# Altium project MCP33151 Eval Board.PrjPcb (part 2 of 3)

## Sheet Digital IO Protection.SchDoc: Digital IO Protection
size B; DrawnBy: Jasper Yun; SheetNumber: 6; SheetTotal: 11; Competition: SAC 2021; Subteam: Avionics; University: McGill University; Location: Montreal, Quebec; Project: Avionics Project Name; MRT: McGill Rocket Team
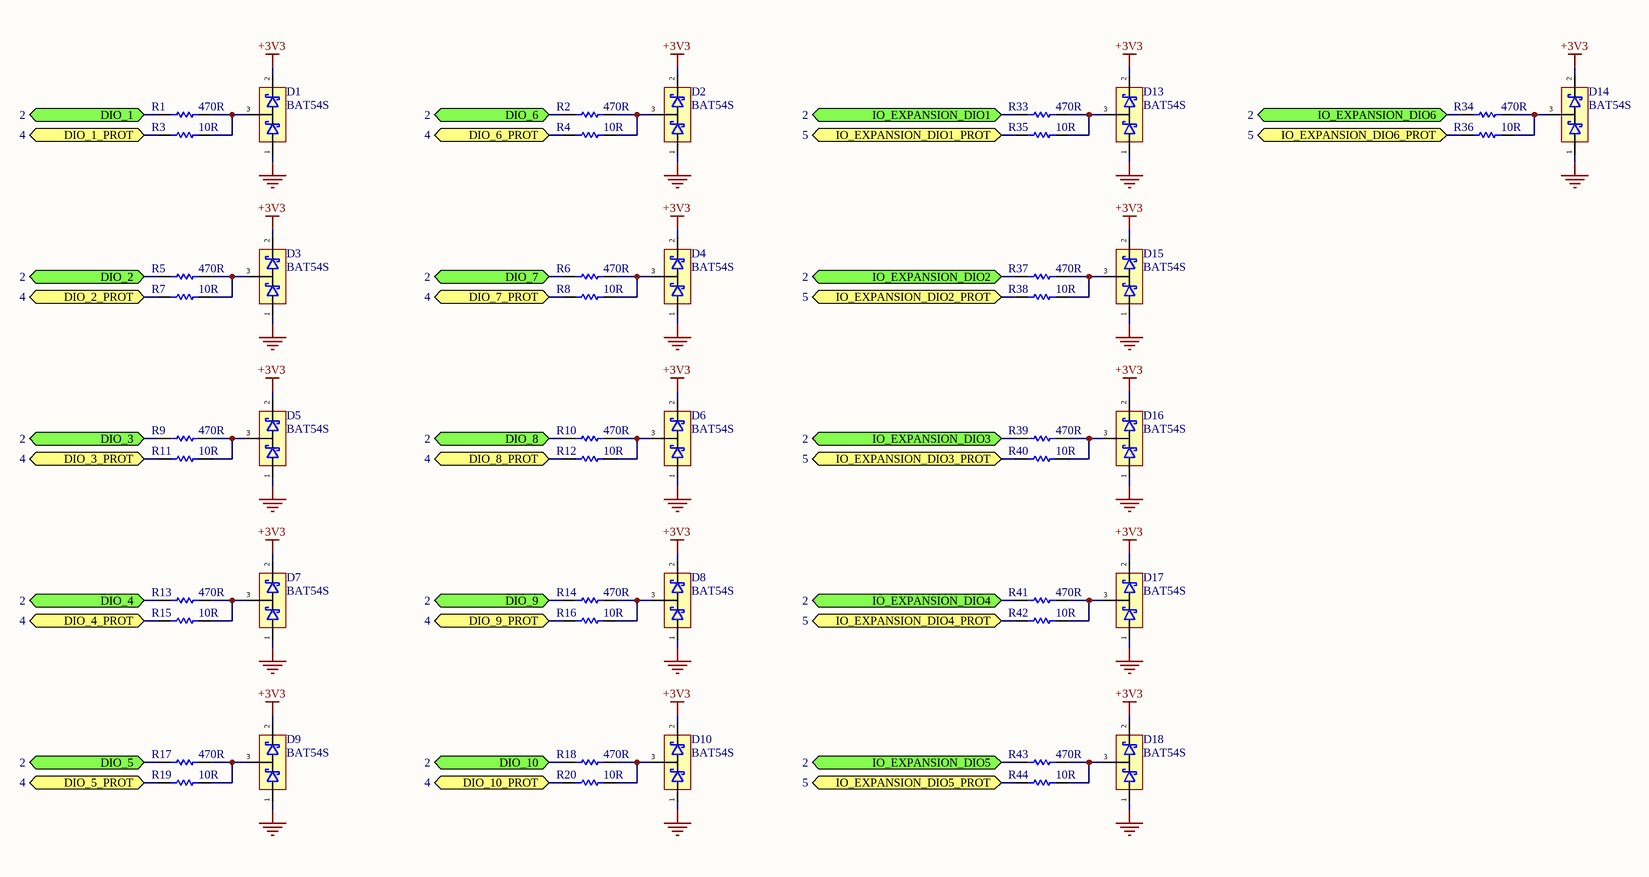
[diagram p5: Digital IO Protection.SchDoc]

### Parts
D1  BAT54S  [SOT23-3]
D2  BAT54S  [SOT23-3]
D3  BAT54S  [SOT23-3]
D4  BAT54S  [SOT23-3]
D5  BAT54S  [SOT23-3]
D6  BAT54S  [SOT23-3]
D7  BAT54S  [SOT23-3]
D8  BAT54S  [SOT23-3]
D9  BAT54S  [SOT23-3]
D10  BAT54S  [SOT23-3]
D13  BAT54S  [SOT23-3]
D14  BAT54S  [SOT23-3]
D15  BAT54S  [SOT23-3]
D16  BAT54S  [SOT23-3]
D17  BAT54S  [SOT23-3]
D18  BAT54S  [SOT23-3]
R1  470R  [0805 RES]
R2  470R  [0805 RES]
R3  10R  [0603 RES]
R4  10R  [0603 RES]
R5  470R  [0805 RES]
R6  470R  [0805 RES]
R7  10R  [0603 RES]
R8  10R  [0603 RES]
R9  470R  [0805 RES]
R10  470R  [0805 RES]
R11  10R  [0603 RES]
R12  10R  [0603 RES]
R13  470R  [0805 RES]
R14  470R  [0805 RES]
R15  10R  [0603 RES]
R16  10R  [0603 RES]
R17  470R  [0805 RES]
R18  470R  [0805 RES]
R19  10R  [0603 RES]
R20  10R  [0603 RES]
R33  470R  [0805 RES]
R34  470R  [0805 RES]
R35  10R  [0603 RES]
R36  10R  [0603 RES]
R37  470R  [0805 RES]
R38  10R  [0603 RES]
R39  470R  [0805 RES]
R40  10R  [0603 RES]
R41  470R  [0805 RES]
R42  10R  [0603 RES]
R43  470R  [0805 RES]
R44  10R  [0603 RES]

### Ports
DIO_1 (bidir, see 2), DIO_1_PROT (bidir, see 4), DIO_2 (bidir, see 2), DIO_2_PROT (bidir, see 4), DIO_3 (bidir, see 2), DIO_3_PROT (bidir, see 4), DIO_4 (bidir, see 2), DIO_4_PROT (bidir, see 4), DIO_5 (bidir, see 2), DIO_5_PROT (bidir, see 4), DIO_6 (bidir, see 2), DIO_6_PROT (bidir, see 4), DIO_7 (bidir, see 2), DIO_7_PROT (bidir, see 4), DIO_8 (bidir, see 2), DIO_8_PROT (bidir, see 4), DIO_9 (bidir, see 2), DIO_9_PROT (bidir, see 4), DIO_10 (bidir, see 2), DIO_10_PROT (bidir, see 4), IO_EXPANSION_DIO1 (bidir, see 2), IO_EXPANSION_DIO1_PROT (bidir, see 5), IO_EXPANSION_DIO2 (bidir, see 2), IO_EXPANSION_DIO2_PROT (bidir, see 5), IO_EXPANSION_DIO3 (bidir, see 2), IO_EXPANSION_DIO3_PROT (bidir, see 5), IO_EXPANSION_DIO4 (bidir, see 2), IO_EXPANSION_DIO4_PROT (bidir, see 5), IO_EXPANSION_DIO5 (bidir, see 2), IO_EXPANSION_DIO5_PROT (bidir, see 5), IO_EXPANSION_DIO6 (bidir, see 2), IO_EXPANSION_DIO6_PROT (bidir, see 5)

### Nets
+3V3: D1.2 D2.2 D3.2 D4.2 D5.2 D6.2 D7.2 D8.2 D9.2 D10.2 D13.2 D14.2 D15.2 D16.2 D17.2 D18.2
GND: D1.1 D2.1 D3.1 D4.1 D5.1 D6.1 D7.1 D8.1 D9.1 D10.1 D13.1 D14.1 D15.1 D16.1 D17.1 D18.1
DIO_1: R1.1 ; port DIO_1
DIO_1_PROT: R3.1 ; port DIO_1_PROT
DIO_2: R5.1 ; port DIO_2
DIO_2_PROT: R7.1 ; port DIO_2_PROT
DIO_3: R9.1 ; port DIO_3
DIO_3_PROT: R11.1 ; port DIO_3_PROT
DIO_4: R13.1 ; port DIO_4
DIO_4_PROT: R15.1 ; port DIO_4_PROT
DIO_5: R17.1 ; port DIO_5
DIO_5_PROT: R19.1 ; port DIO_5_PROT
DIO_6: R2.1 ; port DIO_6
DIO_6_PROT: R4.1 ; port DIO_6_PROT
DIO_7: R6.1 ; port DIO_7
DIO_7_PROT: R8.1 ; port DIO_7_PROT
DIO_8: R10.1 ; port DIO_8
DIO_8_PROT: R12.1 ; port DIO_8_PROT
DIO_9: R14.1 ; port DIO_9
DIO_9_PROT: R16.1 ; port DIO_9_PROT
DIO_10: R18.1 ; port DIO_10
DIO_10_PROT: R20.1 ; port DIO_10_PROT
IO_EXPANSION_DIO1: R33.1 ; port IO_EXPANSION_DIO1
IO_EXPANSION_DIO1_PROT: R35.1 ; port IO_EXPANSION_DIO1_PROT
IO_EXPANSION_DIO2: R37.1 ; port IO_EXPANSION_DIO2
IO_EXPANSION_DIO2_PROT: R38.1 ; port IO_EXPANSION_DIO2_PROT
IO_EXPANSION_DIO3: R39.1 ; port IO_EXPANSION_DIO3
IO_EXPANSION_DIO3_PROT: R40.1 ; port IO_EXPANSION_DIO3_PROT
IO_EXPANSION_DIO4: R41.1 ; port IO_EXPANSION_DIO4
IO_EXPANSION_DIO4_PROT: R42.1 ; port IO_EXPANSION_DIO4_PROT
IO_EXPANSION_DIO5: R43.1 ; port IO_EXPANSION_DIO5
IO_EXPANSION_DIO5_PROT: R44.1 ; port IO_EXPANSION_DIO5_PROT
IO_EXPANSION_DIO6: R34.1 ; port IO_EXPANSION_DIO6
IO_EXPANSION_DIO6_PROT: R36.1 ; port IO_EXPANSION_DIO6_PROT
NetD1_3: D1.3 R1.2 R3.2
NetD2_3: D2.3 R2.2 R4.2
NetD3_3: D3.3 R5.2 R7.2
NetD4_3: D4.3 R6.2 R8.2
NetD5_3: D5.3 R9.2 R11.2
NetD6_3: D6.3 R10.2 R12.2
NetD7_3: D7.3 R13.2 R15.2
NetD8_3: D8.3 R14.2 R16.2
NetD9_3: D9.3 R17.2 R19.2
NetD10_3: D10.3 R18.2 R20.2
NetD13_3: D13.3 R33.2 R35.2
NetD14_3: D14.3 R34.2 R36.2
NetD15_3: D15.3 R37.2 R38.2
NetD16_3: D16.3 R39.2 R40.2
NetD17_3: D17.3 R41.2 R42.2
NetD18_3: D18.3 R43.2 R44.2

### Notes on the sheet
- Title
- Size:
- Date:
- B
- Revision:
- Time:
- Drawn By:
- Sheet
- of
- File:

### Library data of the parts
D1-D10 D13-D18 = Schottky Diode Array BAT54S: Rectifier Diode Small Signal Schottky 40V 0.3A 5ns 3-Pin SOT-23 T/R; Manufacturer: STMicroelectronics; Manufacturer Part Number: BAT54SFILM; Forward Current: 300mA; Peak Non-Repetitive Surge Current: 1A; Forward Voltage: 900mV; Max Reverse Current: 100uA; Max Reverse Leakage Current: 1uA; Element Configuration: Single; Voltage Rating (DC): 30V; Supplier 1: Digi-Key; RoHS: Yes; Category: Rectifier Diodes; Stock 1: 2760; Pricing 1: 1=0.34000, 10=0.27800, 100=0.14730, 500=0.09694, 1000=0.06592 (USD); Mount: Surface Mount; Case/Package: SOT-23; Number of Pins: 3; Weight: 0.1lb; Min Operating Temperature: -40°C; Max Operating Temperature: 150°C; Reverse Recovery Time: 5ns; Max Repetitive Reverse Voltage (Vrrm): 40V; Packaging: Tape and Reel; Package Quantity: 3000; Average Rectified Current: 300mA; Max Forward Surge Current (Ifsm): 1A; Max Reverse Voltage (DC): 40V; Max Surge Current: 1A; Recovery Time: 5ns; Termination: SMD/SMT; Current Rating: 300mA; Length: 2.9mm; Width: 3.05mm; Height: 0.95mm; Radiation Hardening: No; REACH SVHC: No SVHC; RoHS Compliant: Yes; Lead Free: Lead Free; ComponentLink1URL: https://datasheet.ciiva.com/1200/1689724-1200683.pdf?src-supplier=Farnell; ComponentLink1Description: https://datasheet.ciiva.com/1200/1689724-1200683.pdf?src-supplier=Farnell; ComponentLink2URL: https://datasheet.ciiva.com/1177/1689724-1177974.pdf?src-supplier=Element14; ComponentLink2Description: https://datasheet.ciiva.com/1177/1689724-1177974.pdf?src-supplier=Element14; ComponentLink3URL: https://datasheet.ciiva.com/1200/cd00001322-1200682.pdf?src-supplier=Farnell; ComponentLink3Description: https://datasheet.ciiva.com/1200/cd00001322-1200682.pdf?src-supplier=Farnell; ComponentLink4URL: https://datasheet.ciiva.com/14168/cd00001322-14168028.pdf?src-supplier=Distrelec; ComponentLink4Description: https://datasheet.ciiva.com/14168/cd00001322-14168028.pdf?src-supplier=Distrelec; ComponentLink5URL: https://datasheet.ciiva.com/905/cd00001322-905882.pdf?src-supplier=Digi-Key; ComponentLink5Description: https://datasheet.ciiva.com/905/cd00001322-905882.pdf?src-supplier=Digi-Key; ComponentLink6URL: https://datasheet.ciiva.com/905/cd00001322-905881.pdf?src-supplier=Digi-Key; ComponentLink6Description: https://datasheet.ciiva.com/905/cd00001322-905881.pdf?src-supplier=Digi-Key; ComponentLink7URL: https://datasheet.ciiva.com/905/cd00001322-905883.pdf?src-supplier=Digi-Key; ComponentLink7Description: https://datasheet.ciiva.com/905/cd00001322-905883.pdf?src-supplier=Digi-Key; ComponentLink8URL: https://datasheet.ciiva.com/1177/1689724-1177973.pdf?src-supplier=Element14; ComponentLink8Description: https://datasheet.ciiva.com/1177/1689724-1177973.pdf?src-supplier=Element14; Supplier Part Number 1: 497-2522-1-ND
R1-R20 R33-R44 = Res1: Published: 8-Jun-2000; LatestRevisionDate: 17-Jul-2002; LatestRevisionNote: Re-released for DXP Platform.; PackageReference: AXIAL-0.3; Publisher: Altium Limited; PackageDescription: Axial Device, Thru-Hole; 2 Leads; 0.3 in Pin Spacing
  R1 R2 R5 R6 R9 R10 R13 R14 R17 R18 R33 R34 R37 R39 R41 R43: Value: 470R
  R3 R4 R7 R8 R11 R12 R15 R16 R19 R20 R35 R36 R38 R40 R42 R44: Value: 10R

## Sheet Analog - High Speed DE.SchDoc: Analog - High Speed Differential
size B; DrawnBy: Jasper Yun; SheetNumber: 7; SheetTotal: 11; Competition: SAC 2021; Subteam: Avionics; University: McGill University; Location: Montreal, Quebec; Project: Avionics Project Name; MRT: McGill Rocket Team
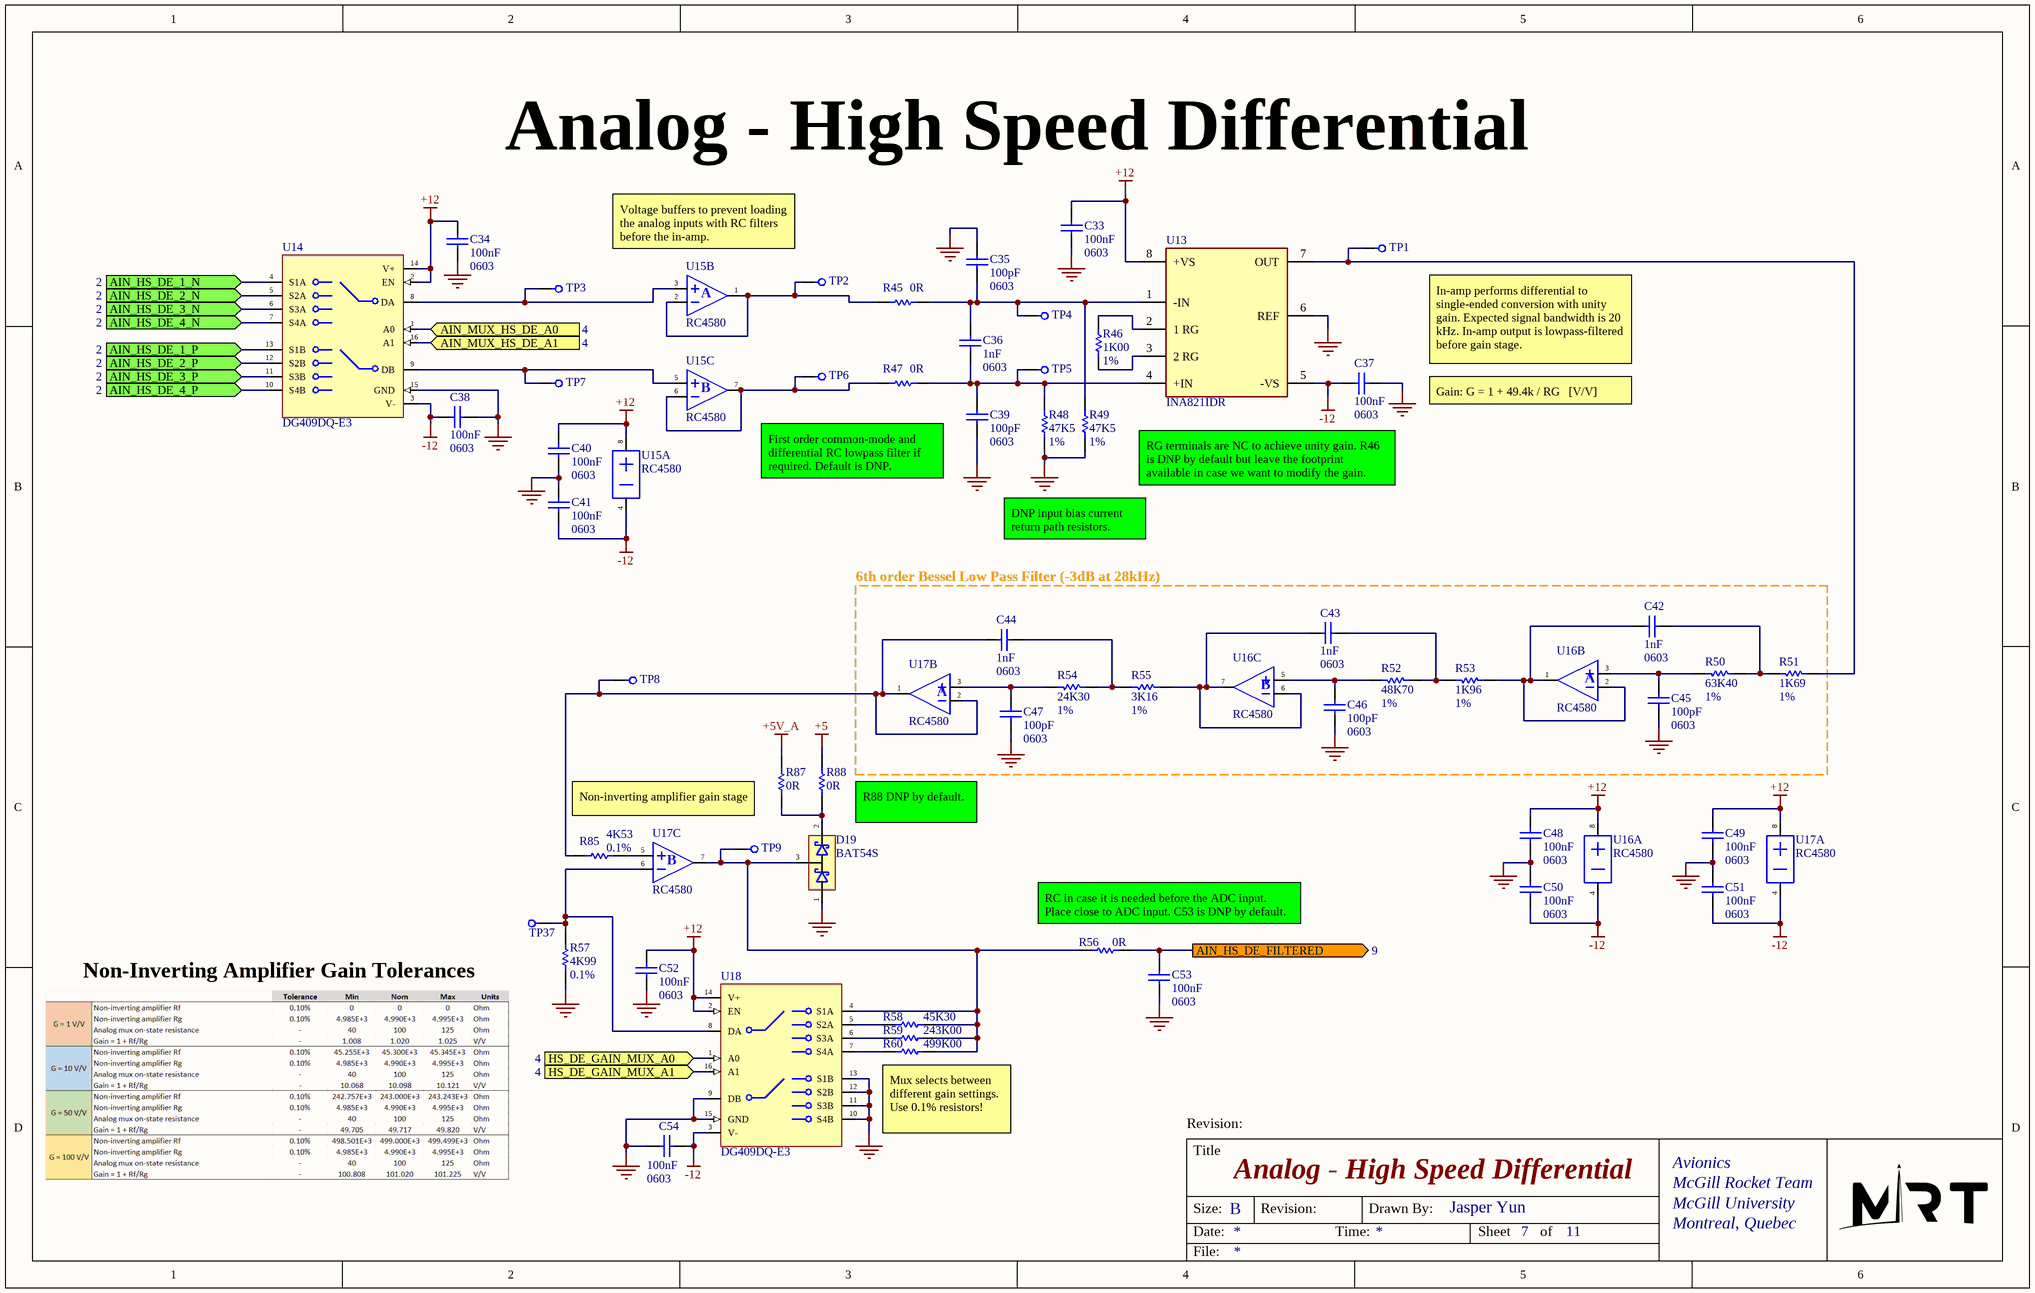
[diagram p6: Analog - High Speed DE.SchDoc]

### Parts
C33  100nF  value 0603  [0603 CAP SAMSUNG CL10C]
C34  100nF  value 0603  [0603 CAP SAMSUNG CL10C]
C35  100pF  value 0603  [0603 CAP SAMSUNG CL10C]
C36  1nF  value 0603  [0603 CAP SAMSUNG CL10C]
C37  100nF  value 0603  [0603 CAP SAMSUNG CL10C]
C38  100nF  value 0603  [0603 CAP SAMSUNG CL10C]
C39  100pF  value 0603  [0603 CAP SAMSUNG CL10C]
C40  100nF  value 0603  [0603 CAP SAMSUNG CL10C]
C41  100nF  value 0603  [0603 CAP SAMSUNG CL10C]
C42  1nF  value 0603  [0603 CAP SAMSUNG CL10C]
C43  1nF  value 0603  [0603 CAP SAMSUNG CL10C]
C44  1nF  value 0603  [0603 CAP SAMSUNG CL10C]
C45  100pF  value 0603  [0603 CAP SAMSUNG CL10C]
C46  100pF  value 0603  [0603 CAP SAMSUNG CL10C]
C47  100pF  value 0603  [0603 CAP SAMSUNG CL10C]
C48  100nF  value 0603  [0603 CAP SAMSUNG CL10C]
C49  100nF  value 0603  [0603 CAP SAMSUNG CL10C]
C50  100nF  value 0603  [0603 CAP SAMSUNG CL10C]
C51  100nF  value 0603  [0603 CAP SAMSUNG CL10C]
C52  100nF  value 0603  [0603 CAP SAMSUNG CL10C]
C53  100nF  value 0603  [0603 CAP SAMSUNG CL10C]
C54  100nF  value 0603  [0603 CAP SAMSUNG CL10C]
D19  BAT54S  [SOT23-3]
R45  0R  [0603 RES]
R46  1K00  value 1%  [0603 RES]
R47  0R  [0603 RES]
R48  47K5  value 1%  [0603 RES]
R49  47K5  value 1%  [0603 RES]
R50  63K40  value 1%  [0603 RES]
R51  1K69  value 1%  [0603 RES]
R52  48K70  value 1%  [0603 RES]
R53  1K96  value 1%  [0603 RES]
R54  24K30  value 1%  [0603 RES]
R55  3K16  value 1%  [0603 RES]
R56  0R  [0603 RES]
R57  4K99  value 0.1%  [0603 RES]
R58  45K30  [0603 RES]
R59  243K00  [0603 RES]
R60  499K00  [0603 RES]
R85  4K53  value 0.1%  [0603 RES]
R87  0R  [0603 RES]
R88  0R  [0603 RES]
TP1  Test Point  [Test Point Keystone 5015]  (value not drawn)
TP2  Test Point  [TEST POINT SMD PAD]  (value not drawn)  (no BOM)
TP3  Test Point  [TEST POINT SMD PAD]  (value not drawn)  (no BOM)
TP4  Test Point  [TEST POINT SMD PAD]  (value not drawn)  (no BOM)
TP5  Test Point  [TEST POINT SMD PAD]  (value not drawn)  (no BOM)
TP6  Test Point  [TEST POINT SMD PAD]  (value not drawn)  (no BOM)
TP7  Test Point  [TEST POINT SMD PAD]  (value not drawn)  (no BOM)
TP8  Test Point  [Test Point Keystone 5015]  (value not drawn)
TP9  Test Point  [Test Point Keystone 5015]  (value not drawn)
TP37  Test Point  [Test Point Keystone 5015]  (value not drawn)
U13  INA821IDR  [FP-D0008A-IPC_A]
U14  DG409DQ-E3  [TSSOP-16]
U15  RC4580  [SOIC-8]  (parts A,B,C of 3)
U16  RC4580  [SOIC-8]  (parts A,B,C of 3)
U17  RC4580  [SOIC-8]  (parts A,B,C of 3)
U18  DG409DQ-E3  [TSSOP-16]

### Blocks framed on the sheet
6th order Bessel Low Pass Filter (-3dB at 28kHz): C42-C47 R50-R55 U16 U17

### Ports
AIN_HS_DE_1_N (in, see 2), AIN_HS_DE_1_P (in, see 2), AIN_HS_DE_2_N (in, see 2), AIN_HS_DE_2_P (in, see 2), AIN_HS_DE_3_N (in, see 2), AIN_HS_DE_3_P (in, see 2), AIN_HS_DE_4_N (in, see 2), AIN_HS_DE_4_P (in, see 2), AIN_HS_DE_FILTERED (out, see 9), AIN_MUX_HS_DE_A0 (in, see 4), AIN_MUX_HS_DE_A1 (in, see 4), HS_DE_GAIN_MUX_A0 (in, see 4), HS_DE_GAIN_MUX_A1 (in, see 4)

### Nets
+5: R88.1
+5V_A: R87.1
+12: C33.2 C34.2 C40.2 C48.2 C49.2 C52.2 U13.8(+VS) U14.2(EN) U14.14(V+) U15.8(VCC+) U16.8(VCC+) U17.8(VCC+) U18.2(EN) U18.14(V+)
-12: C37.2 C38.2 C41.1 C50.1 C51.1 C54.2 U13.5(-VS) U14.3(V-) U15.4(VCC-) U16.4(VCC-) U17.4(VCC-) U18.3(V-)
GND: C33.1 C34.1 C35.2 C37.1 C38.1 C39.1 C40.1 C41.2 C45.1 C46.1 C47.1 C48.1 C49.1 C50.2 C51.2 C52.1 C53.1 C54.1 D19.1 R48.1 R49.1 R57.1 U13.6(REF) U14.15(GND) U18.9(DB) U18.10(S4B) U18.11(S3B) U18.12(S2B) U18.13(S1B) U18.15(GND)
AIN_HS_DE_1_N: U14.4(S1A) ; port AIN_HS_DE_1_N
AIN_HS_DE_1_P: U14.13(S1B) ; port AIN_HS_DE_1_P
AIN_HS_DE_2_N: U14.5(S2A) ; port AIN_HS_DE_2_N
AIN_HS_DE_2_P: U14.12(S2B) ; port AIN_HS_DE_2_P
AIN_HS_DE_3_N: U14.6(S3A) ; port AIN_HS_DE_3_N
AIN_HS_DE_3_P: U14.11(S3B) ; port AIN_HS_DE_3_P
AIN_HS_DE_4_N: U14.7(S4A) ; port AIN_HS_DE_4_N
AIN_HS_DE_4_P: U14.10(S4B) ; port AIN_HS_DE_4_P
AIN_HS_DE_FILTERED: C53.2 R56.1 ; port AIN_HS_DE_FILTERED
AIN_MUX_HS_DE_A0: U14.1(A0) ; port AIN_MUX_HS_DE_A0
AIN_MUX_HS_DE_A1: U14.16(A1) ; port AIN_MUX_HS_DE_A1
HS_DE_GAIN_MUX_A0: U18.1(A0) ; port HS_DE_GAIN_MUX_A0
HS_DE_GAIN_MUX_A1: U18.16(A1) ; port HS_DE_GAIN_MUX_A1
NetC35_1: C35.1 C36.2 R45.1 R49.2 TP4.1 U13.1(-IN)
NetC36_1: C36.1 C39.2 R47.1 R48.2 TP5.1 U13.4(+IN)
NetC42_1: C42.1 R53.1 U16.1 U16.2
NetC42_2: C42.2 R50.1 R51.2
NetC43_1: C43.1 R55.1 U16.6 U16.7
NetC43_2: C43.2 R52.1 R53.2
NetC44_1: C44.1 R85.2 TP8.1 U17.1 U17.2
NetC44_2: C44.2 R54.1 R55.2
NetC45_2: C45.2 R50.2 U16.3
NetC46_2: C46.2 R52.2 U16.5
NetC47_2: C47.2 R54.2 U17.3
NetD19_2: D19.2 R87.2 R88.2
NetD19_3: D19.3 R56.2 R58.1 R59.1 R60.1 TP9.1 U17.7 U18.4(S1A)
NetR45_2: R45.2 TP2.1 U15.1 U15.2
NetR46_1: R46.1 U13.3(2_RG)
NetR46_2: R46.2 U13.2(1_RG)
NetR47_2: R47.2 TP6.1 U15.6 U15.7
NetR51_1: R51.1 TP1.1 U13.7(OUT)
NetR57_2: R57.2 TP37.1 U17.6 U18.8(DA)
NetR58_2: R58.2 U18.5(S2A)
NetR59_2: R59.2 U18.6(S3A)
NetR60_2: R60.2 U18.7(S4A)
NetR85_1: R85.1 U17.5
NetTP3_1: TP3.1 U14.8(DA) U15.3
NetTP7_1: TP7.1 U14.9(DB) U15.5

### Notes on the sheet
- Voltage buffers to prevent loading the analog inputs with RC filters before the in-amp.
- In-amp performs differential to single-ended conversion with unity gain. Expected signal bandwidth is 20 kHz. In-amp output is lowpass-filtered before gain stage.
- Gain: G = 1 + 49.4k / RG   [V/V]
- First order common-mode and differential RC lowpass filter if required. Default is DNP.
- RG terminals are NC to achieve unity gain. R46 is DNP by default but leave the footprint available in case we want to modify the gain.
- DNP input bias current return path resistors.
- Non-inverting amplifier gain stage
- R88 DNP by default.
- (near R56) RC in case it is needed before the ADC input. Place close to ADC input. C53 is DNP by default.
- Non-Inverting Amplifier Gain Tolerances
- (near R60) Mux selects between different gain settings.
  Use 0.1% resistors!
- Title
- Size:
- Date:
- B
- Revision:
- Time:
- Drawn By:
- Sheet
- of
- File:
- (in symbol OP AMP RC4580, part B) A
- (in symbol OP AMP RC4580, part C) B

### Library data of the parts
C33-C54 = Cap: Capacitor; Published: 8-Jun-2000; LatestRevisionDate: 17-Jul-2002; LatestRevisionNote: Re-released for DXP Platform.; PackageReference: RAD-0.3; Publisher: Altium Limited; PackageDescription: Radial Cap, Thru-Hole; 2 Leads; 0.3 in Pin Spacing
D19 = Schottky Diode Array BAT54S: Rectifier Diode Small Signal Schottky 40V 0.3A 5ns 3-Pin SOT-23 T/R; Manufacturer: STMicroelectronics; Manufacturer Part Number: BAT54SFILM; Forward Current: 300mA; Peak Non-Repetitive Surge Current: 1A; Forward Voltage: 900mV; Max Reverse Current: 100uA; Max Reverse Leakage Current: 1uA; Element Configuration: Single; Voltage Rating (DC): 30V; Supplier 1: Digi-Key; RoHS: Yes; Category: Rectifier Diodes; Stock 1: 2760; Pricing 1: 1=0.34000, 10=0.27800, 100=0.14730, 500=0.09694, 1000=0.06592 (USD); Mount: Surface Mount; Case/Package: SOT-23; Number of Pins: 3; Weight: 0.1lb; Min Operating Temperature: -40°C; Max Operating Temperature: 150°C; Reverse Recovery Time: 5ns; Max Repetitive Reverse Voltage (Vrrm): 40V; Packaging: Tape and Reel; Package Quantity: 3000; Average Rectified Current: 300mA; Max Forward Surge Current (Ifsm): 1A; Max Reverse Voltage (DC): 40V; Max Surge Current: 1A; Recovery Time: 5ns; Termination: SMD/SMT; Current Rating: 300mA; Length: 2.9mm; Width: 3.05mm; Height: 0.95mm; Radiation Hardening: No; REACH SVHC: No SVHC; RoHS Compliant: Yes; Lead Free: Lead Free; ComponentLink1URL: https://datasheet.ciiva.com/1200/1689724-1200683.pdf?src-supplier=Farnell; ComponentLink1Description: https://datasheet.ciiva.com/1200/1689724-1200683.pdf?src-supplier=Farnell; ComponentLink2URL: https://datasheet.ciiva.com/1177/1689724-1177974.pdf?src-supplier=Element14; ComponentLink2Description: https://datasheet.ciiva.com/1177/1689724-1177974.pdf?src-supplier=Element14; ComponentLink3URL: https://datasheet.ciiva.com/1200/cd00001322-1200682.pdf?src-supplier=Farnell; ComponentLink3Description: https://datasheet.ciiva.com/1200/cd00001322-1200682.pdf?src-supplier=Farnell; ComponentLink4URL: https://datasheet.ciiva.com/14168/cd00001322-14168028.pdf?src-supplier=Distrelec; ComponentLink4Description: https://datasheet.ciiva.com/14168/cd00001322-14168028.pdf?src-supplier=Distrelec; ComponentLink5URL: https://datasheet.ciiva.com/905/cd00001322-905882.pdf?src-supplier=Digi-Key; ComponentLink5Description: https://datasheet.ciiva.com/905/cd00001322-905882.pdf?src-supplier=Digi-Key; ComponentLink6URL: https://datasheet.ciiva.com/905/cd00001322-905881.pdf?src-supplier=Digi-Key; ComponentLink6Description: https://datasheet.ciiva.com/905/cd00001322-905881.pdf?src-supplier=Digi-Key; ComponentLink7URL: https://datasheet.ciiva.com/905/cd00001322-905883.pdf?src-supplier=Digi-Key; ComponentLink7Description: https://datasheet.ciiva.com/905/cd00001322-905883.pdf?src-supplier=Digi-Key; ComponentLink8URL: https://datasheet.ciiva.com/1177/1689724-1177973.pdf?src-supplier=Element14; ComponentLink8Description: https://datasheet.ciiva.com/1177/1689724-1177973.pdf?src-supplier=Element14; Supplier Part Number 1: 497-2522-1-ND
R45 R47 R56 R58-R60 R87 R88 = Res1: Resistor; Value: 1%; Published: 8-Jun-2000; LatestRevisionDate: 17-Jul-2002; LatestRevisionNote: Re-released for DXP Platform.; PackageReference: AXIAL-0.3; Publisher: Altium Limited; PackageDescription: Axial Device, Thru-Hole; 2 Leads; 0.3 in Pin Spacing
R46 R48-R55 R57 R85 = Res1: Resistor; Published: 8-Jun-2000; LatestRevisionDate: 17-Jul-2002; LatestRevisionNote: Re-released for DXP Platform.; PackageReference: AXIAL-0.3; Publisher: Altium Limited; PackageDescription: Axial Device, Thru-Hole; 2 Leads; 0.3 in Pin Spacing
TP1-TP9 TP37 = Test Point: Keystone 5015 Test point
U13 = CMP-04895-000157-1: IC INST AMP 1 CIRCUIT 8SOIC; RoHS Compliant: Yes
U14 U18 = Analog Mux DG409DQ-E3: DG409 Series 20 V 8-Ch/Dual 4-Ch High-Performance CMOS Analog Multiplexer; Manufacturer: Vishay Siliconix; Min Supply Voltage: 13V; Max Supply Voltage: 44V; Number of Inputs: 8; Number of Outputs: 2; Number of Channels: 4; Min Dual Supply Voltage: 5V; Max Dual Supply Voltage: 20V; Propagation Delay: 160ns; On-State Resistance: 90R; Operating Supply Current: 1uA; Turn-On Delay Time: 150ns; Max Power Dissipation: 600mW; Max Supply Current: 500uA; Supply Type: Dual,Single; Dual Supply Voltage: 15V; Operating Supply Voltage: 36V; Supplier 1: Mouser; Manufacturer Part Number: DG409DQ-E3; RoHS: Yes; Category: Decoders and Multiplexers; Stock 1: 4584; Pricing 1: 1=4.36000, 10=3.91000, 50=3.70000, 100=3.20000, 1000=2.73000, 10000=2.40000 (USD); Mount: Surface Mount; Case/Package: TSSOP; Number of Pins: 16; Weight: 0.006102oz; Min Operating Temperature: -40°C; Max Operating Temperature: 85°C; Package Quantity: 360; Packaging: Rail/Tube; Logic Function: Multiplexer; Turn-Off Delay Time: 150ns; Power Dissipation: 600mW; Series: -; Length: 5.07mm; Width: 4.4mm; Height: 0.92mm; Radiation Hardening: No; Lead Free: Lead Free; RoHS Compliant: Yes; ComponentLink1URL: https://datasheet.ciiva.com/1677/dg408-1677556.pdf?src-supplier=Digi-Key; ComponentLink1Description: https://datasheet.ciiva.com/1677/dg408-1677556.pdf?src-supplier=Digi-Key; ComponentLink2URL: https://datasheet.ciiva.com/2978/dg408-2978747.pdf?src-supplier=Avnet; ComponentLink2Description: https://datasheet.ciiva.com/2978/dg408-2978747.pdf?src-supplier=Avnet; Supplier Part Number 1: 78-DG409DQ-E3
U15-U17 = OP AMP RC4580: 2-channel, 12-MHz, low-noise, low-distortion audio op amp with high output current 8-SOIC -40 to 85; Manufacturer: Texas Instruments; Manufacturer Part Number: RC4580IDR; Min Supply Voltage: 4V; Max Supply Voltage: 32V; Max Dual Supply Voltage: 16V; Min Dual Supply Voltage: 2V; Voltage Gain: 110dB; Common Mode Rejection Ratio: 80dB; Nominal Gain Bandwidth Product: 12MHz; Number of Channels: 2; Slew Rate: 5V/µs; Max I/O Voltage: 3mV; Input Bias Current: 500nA; Operating Supply Current: 6mA; Output Current per Channel: 50mA; Nominal Supply Current: 4.5mA; Dual Supply Voltage: 9V; Load Impedance: 2kR; Supplier 1: Digi-Key; RoHS: Yes; Category: Amplifiers - Op Amps, Buffer, Instrumentation; Stock 1: 3503; Pricing 1: 1=0.46000, 10=0.37400, 25=0.34200, 100=0.25460, 250=0.23072, 500=0.19092, 1000=0.14320 (USD); Case/Package: D; Number of Pins: 8; Weight: 0.002561oz; Contact Plating: Gold; Min Operating Temperature: -40°C; Max Operating Temperature: 85°C; Packaging: Tape and Reel; Package Quantity: 1; Number of Circuits: 2; Gain Bandwidth Product: 12MHz; Input Offset Voltage (Vos): 3mV; Series: -; Supply Current: 4.5mA; Bandwidth: 12MHz; Unity Gain Bandwidth Product: 12MHz; Number of Elements: 2; Technology: BIPOLAR; Radiation Hardening: No; Lead Free: Lead Free; RoHS Compliant: Yes; Reach SVHC Compliant: No SVHC; ComponentLink1URL: https://datasheet.ciiva.com/23806/1716592-23806563.pdf?src-supplier=Newark; ComponentLink1Description: https://datasheet.ciiva.com/23806/1716592-23806563.pdf?src-supplier=Newark; ComponentLink2URL: https://datasheet.ciiva.com/22654/1882301-22654837.pdf?src-supplier=Element14; ComponentLink2Description: https://datasheet.ciiva.com/22654/1882301-22654837.pdf?src-supplier=Element14; ComponentLink3URL: https://datasheet.ciiva.com/46382/1840282-46382300.pdf?src-supplier=Element14; ComponentLink3Description: https://datasheet.ciiva.com/46382/1840282-46382300.pdf?src-supplier=Element14; ComponentLink4URL: https://datasheet.ciiva.com/1796/rc4580-1796261.pdf?src-supplier=Digi-Key; ComponentLink4Description: https://datasheet.ciiva.com/1796/rc4580-1796261.pdf?src-supplier=Digi-Key; ComponentLink5URL: https://datasheet.ciiva.com/1796/rc4580-1796260.pdf?src-supplier=Digi-Key; ComponentLink5Description: https://datasheet.ciiva.com/1796/rc4580-1796260.pdf?src-supplier=Digi-Key; ComponentLink6URL: https://datasheet.ciiva.com/1796/rc4580-1796262.pdf?src-supplier=Digi-Key; ComponentLink6Description: https://datasheet.ciiva.com/1796/rc4580-1796262.pdf?src-supplier=Digi-Key; Supplier Part Number 1: 296-15367-1-ND

## Sheet Analog - Low Speed SE.SchDoc: Analog - Low Speed Single-Ended
size B; DrawnBy: Jasper Yun; SheetNumber: 8; SheetTotal: 11; Competition: SAC 2021; Subteam: Avionics; University: McGill University; Location: Montreal, Quebec; Project: Avionics Project Name; MRT: McGill Rocket Team
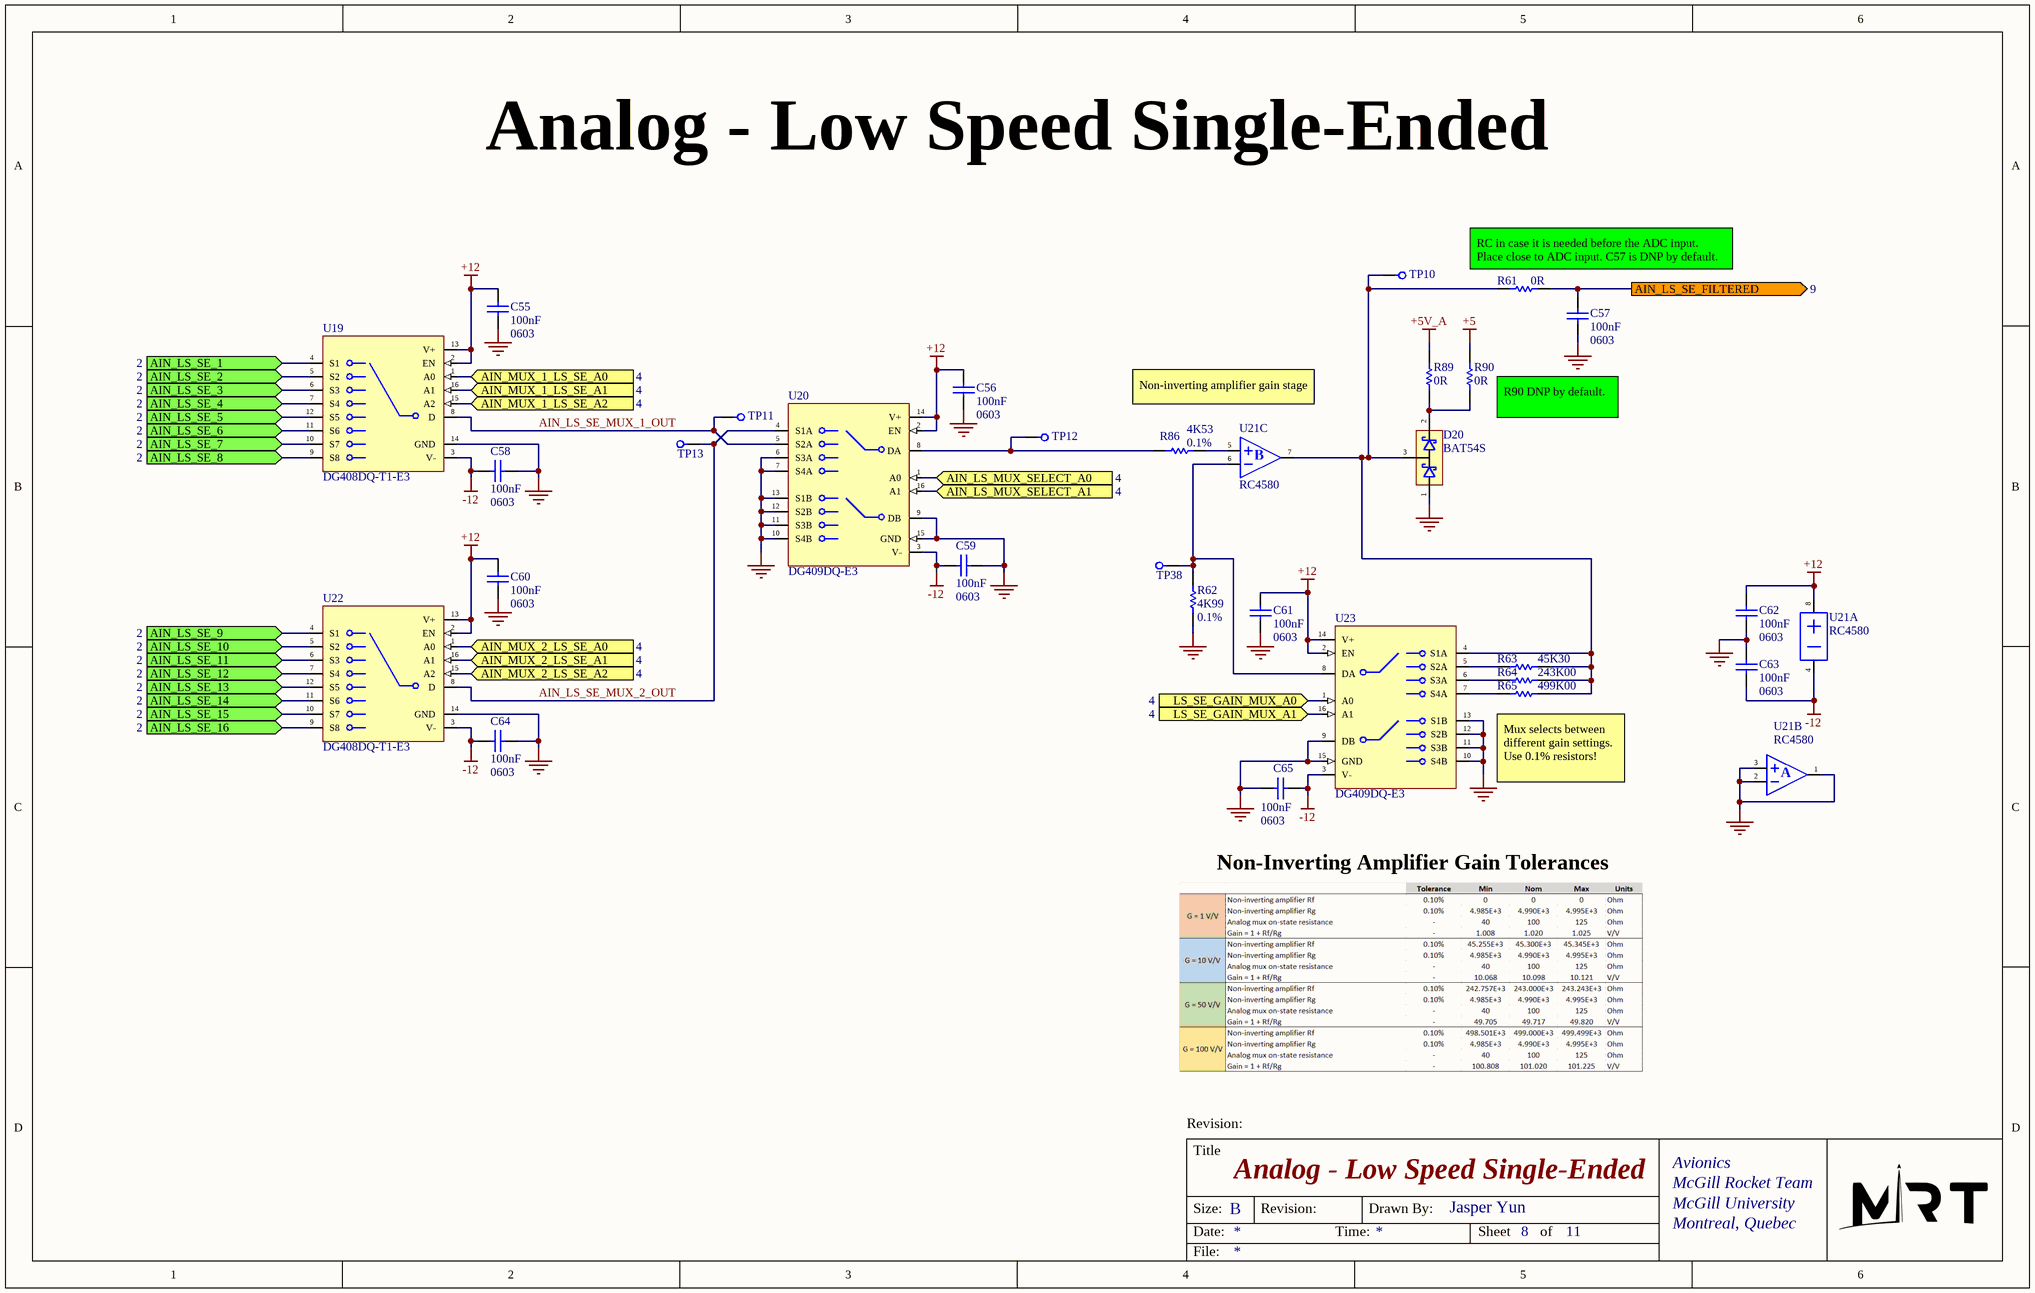
[diagram p7: Analog - Low Speed SE.SchDoc]

### Parts
C55  100nF  value 0603  [0603 CAP SAMSUNG CL10C]
C56  100nF  value 0603  [0603 CAP SAMSUNG CL10C]
C57  100nF  value 0603  [0603 CAP SAMSUNG CL10C]
C58  100nF  value 0603  [0603 CAP SAMSUNG CL10C]
C59  100nF  value 0603  [0603 CAP SAMSUNG CL10C]
C60  100nF  value 0603  [0603 CAP SAMSUNG CL10C]
C61  100nF  value 0603  [0603 CAP SAMSUNG CL10C]
C62  100nF  value 0603  [0603 CAP SAMSUNG CL10C]
C63  100nF  value 0603  [0603 CAP SAMSUNG CL10C]
C64  100nF  value 0603  [0603 CAP SAMSUNG CL10C]
C65  100nF  value 0603  [0603 CAP SAMSUNG CL10C]
D20  BAT54S  [SOT23-3]
R61  0R  [0603 RES]
R62  4K99  value 0.1%  [0603 RES]
R63  45K30  [0603 RES]
R64  243K00  [0603 RES]
R65  499K00  [0603 RES]
R86  4K53  value 0.1%  [0603 RES]
R89  0R  [0603 RES]
R90  0R  [0603 RES]
TP10  Test Point  [Test Point Keystone 5015]  (value not drawn)
TP11  Test Point  [TEST POINT SMD PAD]  (value not drawn)  (no BOM)
TP12  Test Point  [Test Point Keystone 5015]  (value not drawn)
TP13  Test Point  [TEST POINT SMD PAD]  (value not drawn)  (no BOM)
TP38  Test Point  [Test Point Keystone 5015]  (value not drawn)
U19  DG408DQ-T1-E3  [TSSOP-16]
U20  DG409DQ-E3  [TSSOP-16]
U21  RC4580  [SOIC-8]  (parts A,B,C of 3)
U22  DG408DQ-T1-E3  [TSSOP-16]
U23  DG409DQ-E3  [TSSOP-16]

### Ports
AIN_LS_MUX_SELECT_A0 (in, see 4), AIN_LS_MUX_SELECT_A1 (in, see 4), AIN_LS_SE_1 (in, see 2), AIN_LS_SE_2 (in, see 2), AIN_LS_SE_3 (in, see 2), AIN_LS_SE_4 (in, see 2), AIN_LS_SE_5 (in, see 2), AIN_LS_SE_6 (in, see 2), AIN_LS_SE_7 (in, see 2), AIN_LS_SE_8 (in, see 2), AIN_LS_SE_9 (in, see 2), AIN_LS_SE_10 (in, see 2), AIN_LS_SE_11 (in, see 2), AIN_LS_SE_12 (in, see 2), AIN_LS_SE_13 (in, see 2), AIN_LS_SE_14 (in, see 2), AIN_LS_SE_15 (in, see 2), AIN_LS_SE_16 (in, see 2), AIN_LS_SE_FILTERED (out, see 9), AIN_MUX_1_LS_SE_A0 (in, see 4), AIN_MUX_1_LS_SE_A1 (in, see 4), AIN_MUX_1_LS_SE_A2 (in, see 4), AIN_MUX_2_LS_SE_A0 (in, see 4), AIN_MUX_2_LS_SE_A1 (in, see 4), AIN_MUX_2_LS_SE_A2 (in, see 4), LS_SE_GAIN_MUX_A0 (in, see 4), LS_SE_GAIN_MUX_A1 (in, see 4)

### Nets
+5: R90.1
+5V_A: R89.1
+12: C55.2 C56.2 C60.2 C61.2 C62.2 U19.2(EN) U19.13(V+) U20.2(EN) U20.14(V+) U21.8(VCC+) U22.2(EN) U22.13(V+) U23.2(EN) U23.14(V+)
-12: C58.2 C59.2 C63.1 C64.2 C65.2 U19.3(V-) U20.3(V-) U21.4(VCC-) U22.3(V-) U23.3(V-)
GND: C55.1 C56.1 C57.1 C58.1 C59.1 C60.1 C61.1 C62.1 C63.2 C64.1 C65.1 D20.1 R62.1 U19.14(GND) U20.6(S3A) U20.7(S4A) U20.9(DB) U20.10(S4B) U20.11(S3B) U20.12(S2B) U20.13(S1B) U20.15(GND) U21.1 U21.2 U21.3 U22.14(GND) U23.9(DB) U23.10(S4B) U23.11(S3B) U23.12(S2B) U23.13(S1B) U23.15(GND)
AIN_LS_MUX_SELECT_A0: U20.1(A0) ; port AIN_LS_MUX_SELECT_A0
AIN_LS_MUX_SELECT_A1: U20.16(A1) ; port AIN_LS_MUX_SELECT_A1
AIN_LS_SE_1: U19.4(S1) ; port AIN_LS_SE_1
AIN_LS_SE_2: U19.5(S2) ; port AIN_LS_SE_2
AIN_LS_SE_3: U19.6(S3) ; port AIN_LS_SE_3
AIN_LS_SE_4: U19.7(S4) ; port AIN_LS_SE_4
AIN_LS_SE_5: U19.12(S5) ; port AIN_LS_SE_5
AIN_LS_SE_6: U19.11(S6) ; port AIN_LS_SE_6
AIN_LS_SE_7: U19.10(S7) ; port AIN_LS_SE_7
AIN_LS_SE_8: U19.9(S8) ; port AIN_LS_SE_8
AIN_LS_SE_9: U22.4(S1) ; port AIN_LS_SE_9
AIN_LS_SE_10: U22.5(S2) ; port AIN_LS_SE_10
AIN_LS_SE_11: U22.6(S3) ; port AIN_LS_SE_11
AIN_LS_SE_12: U22.7(S4) ; port AIN_LS_SE_12
AIN_LS_SE_13: U22.12(S5) ; port AIN_LS_SE_13
AIN_LS_SE_14: U22.11(S6) ; port AIN_LS_SE_14
AIN_LS_SE_15: U22.10(S7) ; port AIN_LS_SE_15
AIN_LS_SE_16: U22.9(S8) ; port AIN_LS_SE_16
AIN_LS_SE_FILTERED: C57.2 R61.1 ; port AIN_LS_SE_FILTERED
AIN_LS_SE_MUX_1_OUT: TP11.1 U19.8(D) U20.5(S2A)
AIN_LS_SE_MUX_2_OUT: TP13.1 U20.4(S1A) U22.8(D)
AIN_MUX_1_LS_SE_A0: U19.1(A0) ; port AIN_MUX_1_LS_SE_A0
AIN_MUX_1_LS_SE_A1: U19.16(A1) ; port AIN_MUX_1_LS_SE_A1
AIN_MUX_1_LS_SE_A2: U19.15(A2) ; port AIN_MUX_1_LS_SE_A2
AIN_MUX_2_LS_SE_A0: U22.1(A0) ; port AIN_MUX_2_LS_SE_A0
AIN_MUX_2_LS_SE_A1: U22.16(A1) ; port AIN_MUX_2_LS_SE_A1
AIN_MUX_2_LS_SE_A2: U22.15(A2) ; port AIN_MUX_2_LS_SE_A2
LS_SE_GAIN_MUX_A0: U23.1(A0) ; port LS_SE_GAIN_MUX_A0
LS_SE_GAIN_MUX_A1: U23.16(A1) ; port LS_SE_GAIN_MUX_A1
NetD20_2: D20.2 R89.2 R90.2
NetD20_3: D20.3 R61.2 R63.1 R64.1 R65.1 TP10.1 U21.7 U23.4(S1A)
NetR62_2: R62.2 TP38.1 U21.6 U23.8(DA)
NetR63_2: R63.2 U23.5(S2A)
NetR64_2: R64.2 U23.6(S3A)
NetR65_2: R65.2 U23.7(S4A)
NetR86_1: R86.1 U21.5
NetR86_2: R86.2 TP12.1 U20.8(DA)

### Notes on the sheet
- (near R61) RC in case it is needed before the ADC input. Place close to ADC input. C57 is DNP by default.
- Non-inverting amplifier gain stage
- (near R90) R90 DNP by default.
- Mux selects between different gain settings.
  Use 0.1% resistors!
- Non-Inverting Amplifier Gain Tolerances
- Title
- Size:
- Date:
- B
- Revision:
- Time:
- Drawn By:
- Sheet
- of
- File:
- (in symbol OP AMP RC4580, part B) A
- (in symbol OP AMP RC4580, part C) B

### Library data of the parts
C55-C65 = Cap: Capacitor; Published: 8-Jun-2000; LatestRevisionDate: 17-Jul-2002; LatestRevisionNote: Re-released for DXP Platform.; PackageReference: RAD-0.3; Publisher: Altium Limited; PackageDescription: Radial Cap, Thru-Hole; 2 Leads; 0.3 in Pin Spacing
D20 = Schottky Diode Array BAT54S: as D19 on sheet Analog - High Speed DE; Supplier 1: Digi-Key; RoHS: Yes; Category: Rectifier Diodes; Stock 1: 2760; Pricing 1: 1=0.34000, 10=0.27800, 100=0.14730, 500=0.09694, 1000=0.06592 (USD); Mount: Surface Mount; Case/Package: SOT-23; Number of Pins: 3; Weight: 0.1lb; Min Operating Temperature: -40°C; Max Operating Temperature: 150°C; Reverse Recovery Time: 5ns; Max Repetitive Reverse Voltage (Vrrm): 40V; Packaging: Tape and Reel; Package Quantity: 3000; Average Rectified Current: 300mA; Max Forward Surge Current (Ifsm): 1A; Max Reverse Voltage (DC): 40V; Max Surge Current: 1A; Recovery Time: 5ns; Termination: SMD/SMT; Current Rating: 300mA; Length: 2.9mm; Width: 3.05mm; Height: 0.95mm; Radiation Hardening: No; REACH SVHC: No SVHC; RoHS Compliant: Yes; Lead Free: Lead Free; ComponentLink1URL: https://datasheet.ciiva.com/1200/1689724-1200683.pdf?src-supplier=Farnell; ComponentLink1Description: https://datasheet.ciiva.com/1200/1689724-1200683.pdf?src-supplier=Farnell; ComponentLink2URL: https://datasheet.ciiva.com/1177/1689724-1177974.pdf?src-supplier=Element14; ComponentLink2Description: https://datasheet.ciiva.com/1177/1689724-1177974.pdf?src-supplier=Element14; ComponentLink3URL: https://datasheet.ciiva.com/1200/cd00001322-1200682.pdf?src-supplier=Farnell; ComponentLink3Description: https://datasheet.ciiva.com/1200/cd00001322-1200682.pdf?src-supplier=Farnell; ComponentLink4URL: https://datasheet.ciiva.com/14168/cd00001322-14168028.pdf?src-supplier=Distrelec; ComponentLink4Description: https://datasheet.ciiva.com/14168/cd00001322-14168028.pdf?src-supplier=Distrelec; ComponentLink5URL: https://datasheet.ciiva.com/905/cd00001322-905882.pdf?src-supplier=Digi-Key; ComponentLink5Description: https://datasheet.ciiva.com/905/cd00001322-905882.pdf?src-supplier=Digi-Key; ComponentLink6URL: https://datasheet.ciiva.com/905/cd00001322-905881.pdf?src-supplier=Digi-Key; ComponentLink6Description: https://datasheet.ciiva.com/905/cd00001322-905881.pdf?src-supplier=Digi-Key; ComponentLink7URL: https://datasheet.ciiva.com/905/cd00001322-905883.pdf?src-supplier=Digi-Key; ComponentLink7Description: https://datasheet.ciiva.com/905/cd00001322-905883.pdf?src-supplier=Digi-Key; ComponentLink8URL: https://datasheet.ciiva.com/1177/1689724-1177973.pdf?src-supplier=Element14; ComponentLink8Description: https://datasheet.ciiva.com/1177/1689724-1177973.pdf?src-supplier=Element14; Supplier Part Number 1: 497-2522-1-ND
R61 R63-R65 R89 R90 = Res1: Resistor; Value: 1%; Published: 8-Jun-2000; LatestRevisionDate: 17-Jul-2002; LatestRevisionNote: Re-released for DXP Platform.; PackageReference: AXIAL-0.3; Publisher: Altium Limited; PackageDescription: Axial Device, Thru-Hole; 2 Leads; 0.3 in Pin Spacing
R62 R86 = Res1: Resistor; Published: 8-Jun-2000; LatestRevisionDate: 17-Jul-2002; LatestRevisionNote: Re-released for DXP Platform.; PackageReference: AXIAL-0.3; Publisher: Altium Limited; PackageDescription: Axial Device, Thru-Hole; 2 Leads; 0.3 in Pin Spacing
TP10-TP13 TP38 = Test Point: Keystone 5015 Test point
U19 U22 = Analog Mux DG408DQ-T1-E3: DG408DQ-T1-E3; Multiplexer Single 8: 1; 15 V; 18 V; 24 V; 28 V; 16-Pin TSSOP; Manufacturer: Vishay Siliconix; Min Supply Voltage: 13V; Max Supply Voltage: 44V; Number of Inputs: 8; Number of Outputs: 1; Operating Supply Voltage: 36V; Propagation Delay: 160ns; Max Power Dissipation: 600mW; Min Dual Supply Voltage: 5V; Max Dual Supply Voltage: 20V; Dual Supply Voltage: 15V; On-State Resistance: 90R; Turn-On Delay Time: 150ns; Max Supply Current: 500uA; Operating Supply Current: 1uA; Supply Type: Single,Dual; Nominal Supply Current: 10uA; High Level Output Current: 30mA; Supplier 1: RSComponents; Manufacturer Part Number: DG408DQ-T1-E3; RoHS: Yes; Category: Decoders and Multiplexers; Stock 1: 2985; Pricing 1: 5=2.69000, 50=2.02000, 250=1.57000 (GBP); Mount: Surface Mount; Case/Package: TSSOP; Number of Pins: 16; Weight: 0.006102oz; Contact Plating: Tin,Matte; Min Operating Temperature: -40°C; Max Operating Temperature: 85°C; Packaging: Tape and Reel; Number of Channels: 8; Package Quantity: 1; Turn-Off Delay Time: 150ns; Logic Function: Multiplexer; Power Dissipation: 600mW; Number of Circuits: 1; Series: -; Supply Current: 10uA; Length: 5.07mm; Width: 4.4mm; Height: 0.92mm; Radiation Hardening: No; Reach SVHC Compliant: Unknown; Lead Free: Lead Free; RoHS Compliant: Yes; ComponentLink1URL: https://datasheet.ciiva.com/15127/getdatasheetpartid-99309-15127097.pdf?src-supplier=Verical; ComponentLink1Description: https://datasheet.ciiva.com/15127/getdatasheetpartid-99309-15127097.pdf?src-supplier=Verical; ComponentLink2URL: https://datasheet.ciiva.com/11499/dg408-11499135.pdf?src-supplier=Avnet; ComponentLink2Description: https://datasheet.ciiva.com/11499/dg408-11499135.pdf?src-supplier=Avnet; ComponentLink3URL: https://datasheet.ciiva.com/1666/dg408-1666717.pdf?src-supplier=Digi-Key; ComponentLink3Description: https://datasheet.ciiva.com/1666/dg408-1666717.pdf?src-supplier=Digi-Key; ComponentLink4URL: https://datasheet.ciiva.com/1666/dg408-1666718.pdf?src-supplier=Digi-Key; ComponentLink4Description: https://datasheet.ciiva.com/1666/dg408-1666718.pdf?src-supplier=Digi-Key; ComponentLink5URL: https://datasheet.ciiva.com/1666/dg408-1666719.pdf?src-supplier=Digi-Key; ComponentLink5Description: https://datasheet.ciiva.com/1666/dg408-1666719.pdf?src-supplier=Digi-Key; Supplier Part Number 1: 2509481281
U20 U23 = Analog Mux DG409DQ-E3: as U14 on sheet Analog - High Speed DE; Supplier 1: Mouser; Manufacturer Part Number: DG409DQ-E3; RoHS: Yes; Category: Decoders and Multiplexers; Stock 1: 4584; Pricing 1: 1=4.36000, 10=3.91000, 50=3.70000, 100=3.20000, 1000=2.73000, 10000=2.40000 (USD); Mount: Surface Mount; Case/Package: TSSOP; Number of Pins: 16; Weight: 0.006102oz; Min Operating Temperature: -40°C; Max Operating Temperature: 85°C; Package Quantity: 360; Packaging: Rail/Tube; Logic Function: Multiplexer; Turn-Off Delay Time: 150ns; Power Dissipation: 600mW; Series: -; Length: 5.07mm; Width: 4.4mm; Height: 0.92mm; Radiation Hardening: No; Lead Free: Lead Free; RoHS Compliant: Yes; ComponentLink1URL: https://datasheet.ciiva.com/1677/dg408-1677556.pdf?src-supplier=Digi-Key; ComponentLink1Description: https://datasheet.ciiva.com/1677/dg408-1677556.pdf?src-supplier=Digi-Key; ComponentLink2URL: https://datasheet.ciiva.com/2978/dg408-2978747.pdf?src-supplier=Avnet; ComponentLink2Description: https://datasheet.ciiva.com/2978/dg408-2978747.pdf?src-supplier=Avnet; Supplier Part Number 1: 78-DG409DQ-E3
U21 = OP AMP RC4580: as U15 on sheet Analog - High Speed DE; Supplier 1: Digi-Key; RoHS: Yes; Category: Amplifiers - Op Amps, Buffer, Instrumentation; Stock 1: 3503; Pricing 1: 1=0.46000, 10=0.37400, 25=0.34200, 100=0.25460, 250=0.23072, 500=0.19092, 1000=0.14320 (USD); Case/Package: D; Number of Pins: 8; Weight: 0.002561oz; Contact Plating: Gold; Min Operating Temperature: -40°C; Max Operating Temperature: 85°C; Packaging: Tape and Reel; Package Quantity: 1; Number of Circuits: 2; Gain Bandwidth Product: 12MHz; Input Offset Voltage (Vos): 3mV; Series: -; Supply Current: 4.5mA; Bandwidth: 12MHz; Unity Gain Bandwidth Product: 12MHz; Number of Elements: 2; Technology: BIPOLAR; Radiation Hardening: No; Lead Free: Lead Free; RoHS Compliant: Yes; Reach SVHC Compliant: No SVHC; ComponentLink1URL: https://datasheet.ciiva.com/23806/1716592-23806563.pdf?src-supplier=Newark; ComponentLink1Description: https://datasheet.ciiva.com/23806/1716592-23806563.pdf?src-supplier=Newark; ComponentLink2URL: https://datasheet.ciiva.com/22654/1882301-22654837.pdf?src-supplier=Element14; ComponentLink2Description: https://datasheet.ciiva.com/22654/1882301-22654837.pdf?src-supplier=Element14; ComponentLink3URL: https://datasheet.ciiva.com/46382/1840282-46382300.pdf?src-supplier=Element14; ComponentLink3Description: https://datasheet.ciiva.com/46382/1840282-46382300.pdf?src-supplier=Element14; ComponentLink4URL: https://datasheet.ciiva.com/1796/rc4580-1796261.pdf?src-supplier=Digi-Key; ComponentLink4Description: https://datasheet.ciiva.com/1796/rc4580-1796261.pdf?src-supplier=Digi-Key; ComponentLink5URL: https://datasheet.ciiva.com/1796/rc4580-1796260.pdf?src-supplier=Digi-Key; ComponentLink5Description: https://datasheet.ciiva.com/1796/rc4580-1796260.pdf?src-supplier=Digi-Key; ComponentLink6URL: https://datasheet.ciiva.com/1796/rc4580-1796262.pdf?src-supplier=Digi-Key; ComponentLink6Description: https://datasheet.ciiva.com/1796/rc4580-1796262.pdf?src-supplier=Digi-Key; Supplier Part Number 1: 296-15367-1-ND

## Sheet ADC.SchDoc: Analog to Digital Conversion
size B; DrawnBy: Jasper Yun; SheetNumber: 9; SheetTotal: 11; Competition: SAC 2021; Subteam: Avionics; University: McGill University; Location: Montreal, Quebec; Project: Avionics Project Name; MRT: McGill Rocket Team
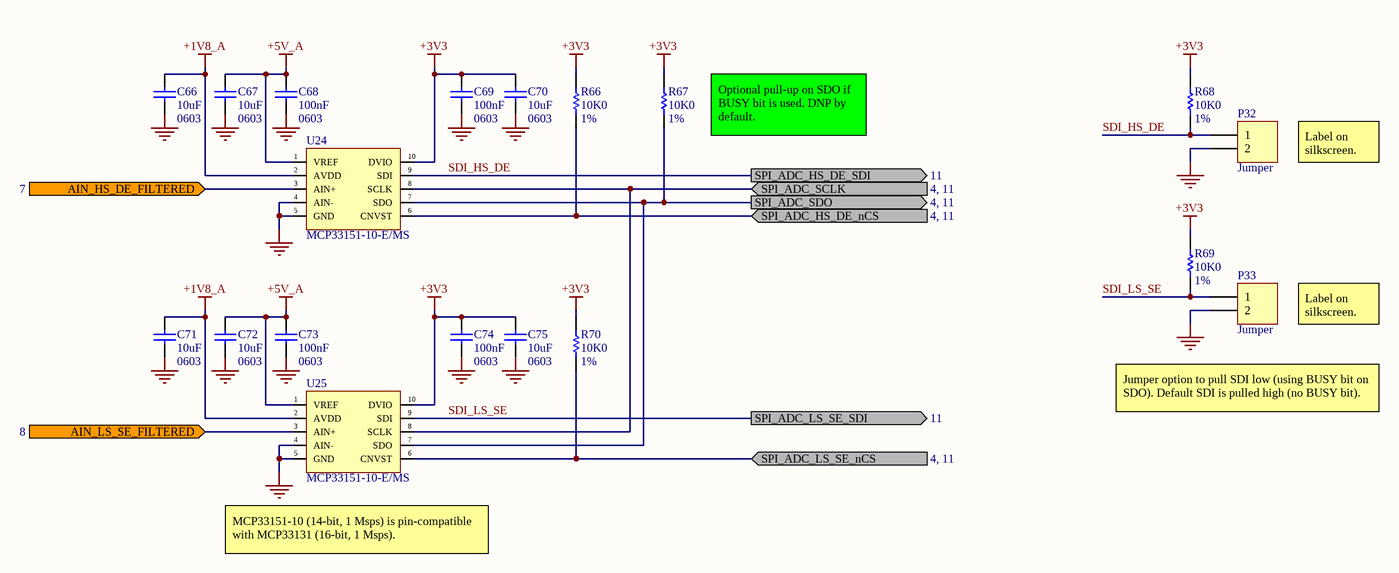
[diagram p8: ADC.SchDoc]

### Parts
C66  10uF  value 0603  [0603 CAP SAMSUNG CL10C]
C67  10uF  value 0603  [0603 CAP SAMSUNG CL10C]
C68  100nF  value 0603  [0603 CAP SAMSUNG CL10C]
C69  100nF  value 0603  [0603 CAP SAMSUNG CL10C]
C70  10uF  value 0603  [0603 CAP SAMSUNG CL10C]
C71  10uF  value 0603  [0603 CAP SAMSUNG CL10C]
C72  10uF  value 0603  [0603 CAP SAMSUNG CL10C]
C73  100nF  value 0603  [0603 CAP SAMSUNG CL10C]
C74  100nF  value 0603  [0603 CAP SAMSUNG CL10C]
C75  10uF  value 0603  [0603 CAP SAMSUNG CL10C]
P32  Jumper  [HDR1X2]
P33  Jumper  [HDR1X2]
R66  10K0  value 1%  [0603 RES]
R67  10K0  value 1%  [0603 RES]
R68  10K0  value 1%  [0603 RES]
R69  10K0  value 1%  [0603 RES]
R70  10K0  value 1%  [0603 RES]
U24  MCP33151-10-E/MS  [MSOP-10]
U25  MCP33151-10-E/MS  [MSOP-10]

### Ports
AIN_HS_DE_FILTERED (in, see 7), AIN_LS_SE_FILTERED (in, see 8), SPI_ADC_HS_DE_nCS (in, see 4, 11), SPI_ADC_HS_DE_SDI (out, see 11), SPI_ADC_LS_SE_nCS (in, see 4, 11), SPI_ADC_LS_SE_SDI (out, see 11), SPI_ADC_SCLK (in, see 4, 11), SPI_ADC_SDO (out, see 4, 11)

### Nets
+1V8_A: C66.2 C71.2 U24.2(AVDD) U25.2(AVDD)
+3V3: C69.2 C70.2 C74.2 C75.2 R66.2 R67.2 R68.2 R69.2 R70.2 U24.10(DVIO) U25.10(DVIO)
+5V_A: C67.2 C68.2 C72.2 C73.2 U24.1(VREF) U25.1(VREF)
GND: C66.1 C67.1 C68.1 C69.1 C70.1 C71.1 C72.1 C73.1 C74.1 C75.1 P32.2 P33.2 U24.4(AIN-) U24.5(GND) U25.4(AIN-) U25.5(GND)
AIN_HS_DE_FILTERED: U24.3(AIN+) ; port AIN_HS_DE_FILTERED
AIN_LS_SE_FILTERED: U25.3(AIN+) ; port AIN_LS_SE_FILTERED
SDI_HS_DE: P32.1 R68.1 U24.9(SDI) ; port SPI_ADC_HS_DE_SDI
SDI_LS_SE: P33.1 R69.1 U25.9(SDI) ; port SPI_ADC_LS_SE_SDI
SPI_ADC_HS_DE_nCS: R66.1 U24.6(CNVST) ; port SPI_ADC_HS_DE_nCS
SPI_ADC_LS_SE_nCS: R70.1 U25.6(CNVST) ; port SPI_ADC_LS_SE_nCS
SPI_ADC_SCLK: U24.8(SCLK) U25.8(SCLK) ; port SPI_ADC_SCLK
SPI_ADC_SDO: R67.1 U24.7(SDO) U25.7(SDO) ; port SPI_ADC_SDO

### Notes on the sheet
- (near R67) Optional pull-up on SDO if BUSY bit is used. DNP by default.
- Label on silkscreen.
- Jumper option to pull SDI low (using BUSY bit on SDO). Default SDI is pulled high (no BUSY bit).
- (near U25) MCP33151-10 (14-bit, 1 Msps) is pin-compatible with MCP33131 (16-bit, 1 Msps).
- Title
- Size:
- Date:
- B
- Revision:
- Time:
- Drawn By:
- Sheet
- of
- File:

### Library data of the parts
C66-C75 = Cap: Capacitor; Published: 8-Jun-2000; LatestRevisionDate: 17-Jul-2002; LatestRevisionNote: Re-released for DXP Platform.; PackageReference: RAD-0.3; Publisher: Altium Limited; PackageDescription: Radial Cap, Thru-Hole; 2 Leads; 0.3 in Pin Spacing
P32 P33 = Header 2: Header, 2-Pin; LatestRevisionDate: 17-Jul-2002; LatestRevisionNote: Re-released for DXP Platform.; Publisher: Altium Limited
R66-R70 = Res1: Resistor; Published: 8-Jun-2000; LatestRevisionDate: 17-Jul-2002; LatestRevisionNote: Re-released for DXP Platform.; PackageReference: AXIAL-0.3; Publisher: Altium Limited; PackageDescription: Axial Device, Thru-Hole; 2 Leads; 0.3 in Pin Spacing
U24 U25 = ADC MCP33151: ADC 14-bit SAR 1Msps 10-MSOP; Manufacturer: Microchip; Supplier 1: Arrow Electronics; Manufacturer Part Number: MCP33151-10-E/MS; RoHS: No; Category: Analog to Digital Converters (ADCs); Stock 1: 90; Pricing 1: 1=2.20600 (USD); Supplier Part Number 1: MCP33151-10-E/MS

## Sheet Relay Drivers.SchDoc: Relay Drivers
size B; DrawnBy: Jasper Yun; SheetNumber: 10; SheetTotal: 11; Competition: SAC 2021; Subteam: Avionics; University: McGill University; Location: Montreal, Quebec; Project: Avionics Project Name; MRT: McGill Rocket Team
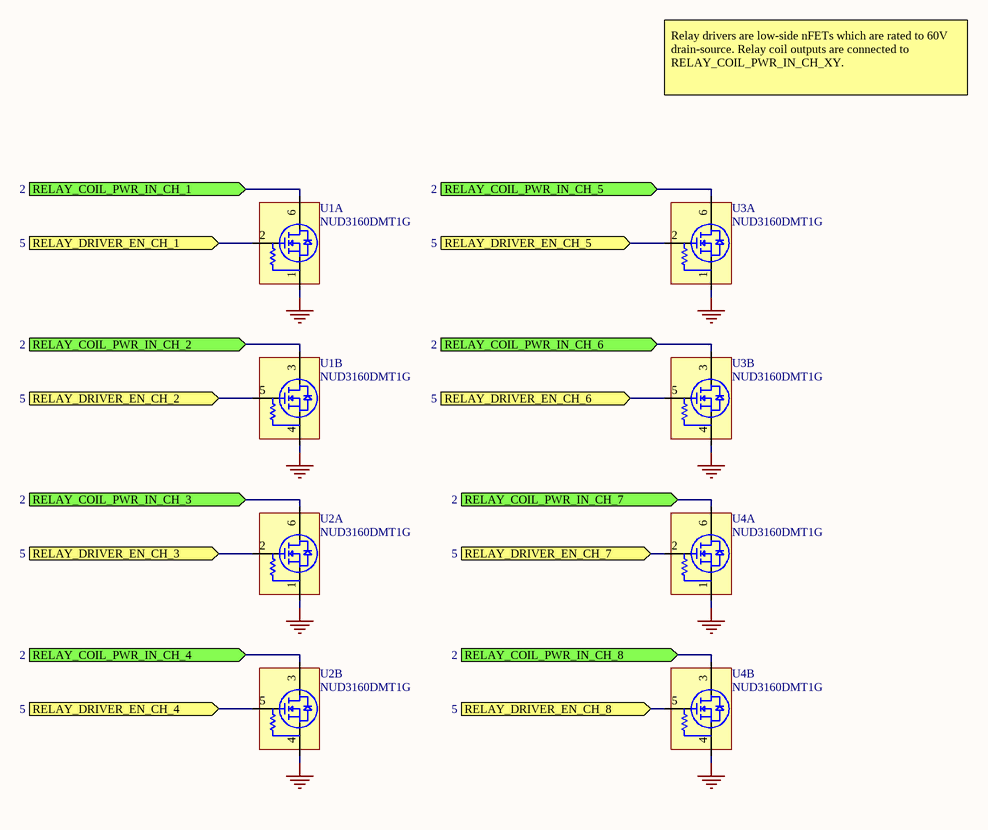
[diagram p9: Relay Drivers.SchDoc]

### Parts
U1  NUD3160DMT1G  [SOT23-6]  (parts A,B of 2)
U2  NUD3160DMT1G  [SOT23-6]  (parts A,B of 2)
U3  NUD3160DMT1G  [SOT23-6]  (parts A,B of 2)
U4  NUD3160DMT1G  [SOT23-6]  (parts A,B of 2)

### Ports
RELAY_COIL_PWR_IN_CH_1 (in, see 2), RELAY_COIL_PWR_IN_CH_2 (in, see 2), RELAY_COIL_PWR_IN_CH_3 (in, see 2), RELAY_COIL_PWR_IN_CH_4 (in, see 2), RELAY_COIL_PWR_IN_CH_5 (in, see 2), RELAY_COIL_PWR_IN_CH_6 (in, see 2), RELAY_COIL_PWR_IN_CH_7 (in, see 2), RELAY_COIL_PWR_IN_CH_8 (in, see 2), RELAY_DRIVER_EN_CH_1 (in, see 5), RELAY_DRIVER_EN_CH_2 (in, see 5), RELAY_DRIVER_EN_CH_3 (in, see 5), RELAY_DRIVER_EN_CH_4 (in, see 5), RELAY_DRIVER_EN_CH_5 (in, see 5), RELAY_DRIVER_EN_CH_6 (in, see 5), RELAY_DRIVER_EN_CH_7 (in, see 5), RELAY_DRIVER_EN_CH_8 (in, see 5)

### Nets
GND: U1.1(Source) U1.4(Source) U2.1(Source) U2.4(Source) U3.1(Source) U3.4(Source) U4.1(Source) U4.4(Source)
RELAY_COIL_PWR_IN_CH_1: U1.6(Drain) ; port RELAY_COIL_PWR_IN_CH_1
RELAY_COIL_PWR_IN_CH_2: U1.3(Drain) ; port RELAY_COIL_PWR_IN_CH_2
RELAY_COIL_PWR_IN_CH_3: U2.6(Drain) ; port RELAY_COIL_PWR_IN_CH_3
RELAY_COIL_PWR_IN_CH_4: U2.3(Drain) ; port RELAY_COIL_PWR_IN_CH_4
RELAY_COIL_PWR_IN_CH_5: U3.6(Drain) ; port RELAY_COIL_PWR_IN_CH_5
RELAY_COIL_PWR_IN_CH_6: U3.3(Drain) ; port RELAY_COIL_PWR_IN_CH_6
RELAY_COIL_PWR_IN_CH_7: U4.6(Drain) ; port RELAY_COIL_PWR_IN_CH_7
RELAY_COIL_PWR_IN_CH_8: U4.3(Drain) ; port RELAY_COIL_PWR_IN_CH_8
RELAY_DRIVER_EN_CH_1: U1.2(Gate) ; port RELAY_DRIVER_EN_CH_1
RELAY_DRIVER_EN_CH_2: U1.5(Gate) ; port RELAY_DRIVER_EN_CH_2
RELAY_DRIVER_EN_CH_3: U2.2(Gate) ; port RELAY_DRIVER_EN_CH_3
RELAY_DRIVER_EN_CH_4: U2.5(Gate) ; port RELAY_DRIVER_EN_CH_4
RELAY_DRIVER_EN_CH_5: U3.2(Gate) ; port RELAY_DRIVER_EN_CH_5
RELAY_DRIVER_EN_CH_6: U3.5(Gate) ; port RELAY_DRIVER_EN_CH_6
RELAY_DRIVER_EN_CH_7: U4.2(Gate) ; port RELAY_DRIVER_EN_CH_7
RELAY_DRIVER_EN_CH_8: U4.5(Gate) ; port RELAY_DRIVER_EN_CH_8

### Notes on the sheet
- Relay drivers are low-side nFETs which are rated to 60V drain-source. Relay coil outputs are connected to RELAY_COIL_PWR_IN_CH_XY.
- Title
- Size:
- Date:
- B
- Revision:
- Time:
- Drawn By:
- Sheet
- of
- File:

### Library data of the parts
U1-U4 = Relay Driver Dual NUD3160DMT1G: IC INDCT LOAD DRVR INDUST SC74-6; Manufacturer: ON Semiconductor; Number of Outputs: 2; Max Supply Voltage: 60V; Rise Time: 600ns; Interface: On/Off; Max Output Current: 150mA; Gate to Source Voltage (Vgs): 12V; Power Dissipation: 380mW; Output Configuration: Low Side; Output Current: 200mA; Output Voltage: 61V; Current Rating: 263mA; Drain to Source Resistance: 1.8R; Element Configuration: Dual; On-State Resistance: 3.7R; Supplier 1: Arrow Electronics; Manufacturer Part Number: NUD3160DMT1G; RoHS: Yes; Category: Hot Swap Controllers; Stock 1: 33; Pricing 1: 1=0.44430, 10=0.32460, 25=0.32120 (USD); Mount: Surface Mount; Case/Package: SC; Number of Pins: 6; Contact Plating: Tin,Matte; Min Operating Temperature: -40°C; Max Operating Temperature: 125°C; Packaging: Tape and Reel; Package Quantity: 3000; Continuous Drain Current (ID): 150mA; Fall Time: 600ns; Number of Elements: 2; Drain to Source Breakdown Voltage: 60V; Drain to Source Voltage (Vdss): 60V; Length: 3mm; Width: 1.5mm; Height: 0.94mm; Radiation Hardening: No; Lead Free: Lead Free; Halogen Free: Halogen Free; RoHS Compliant: Yes; REACH SVHC: No SVHC; ComponentLink1URL: https://datasheet.ciiva.com/1955/nud3160-d-1955024.pdf?src-supplier=Digi-Key; ComponentLink1Description: https://datasheet.ciiva.com/1955/nud3160-d-1955024.pdf?src-supplier=Digi-Key; ComponentLink2URL: https://datasheet.ciiva.com/1609/1786838-1609180.pdf?src-supplier=Newark; ComponentLink2Description: https://datasheet.ciiva.com/1609/1786838-1609180.pdf?src-supplier=Newark; ComponentLink3URL: https://datasheet.ciiva.com/8114/nud3160-d-8114970.pdf?src-supplier=Avnet; ComponentLink3Description: https://datasheet.ciiva.com/8114/nud3160-d-8114970.pdf?src-supplier=Avnet; ComponentLink4URL: https://datasheet.ciiva.com/11168/nud3160-d-11168234.pdf?src-supplier=Avnet; ComponentLink4Description: https://datasheet.ciiva.com/11168/nud3160-d-11168234.pdf?src-supplier=Avnet; ComponentLink5URL: https://datasheet.ciiva.com/1955/nud3160-d-1955025.pdf?src-supplier=Digi-Key; ComponentLink5Description: https://datasheet.ciiva.com/1955/nud3160-d-1955025.pdf?src-supplier=Digi-Key; ComponentLink6URL: https://datasheet.ciiva.com/1955/nud3160-d-1955026.pdf?src-supplier=Digi-Key; ComponentLink6Description: https://datasheet.ciiva.com/1955/nud3160-d-1955026.pdf?src-supplier=Digi-Key; Supplier Part Number 1: NUD3160DMT1G

## Sheet Debug.SchDoc: Debug
size B; DrawnBy: Jasper Yun; SheetNumber: 11; SheetTotal: 11; Competition: SAC 2021; Subteam: Avionics; University: McGill University; Location: Montreal, Quebec; Project: Avionics Project Name; MRT: McGill Rocket Team
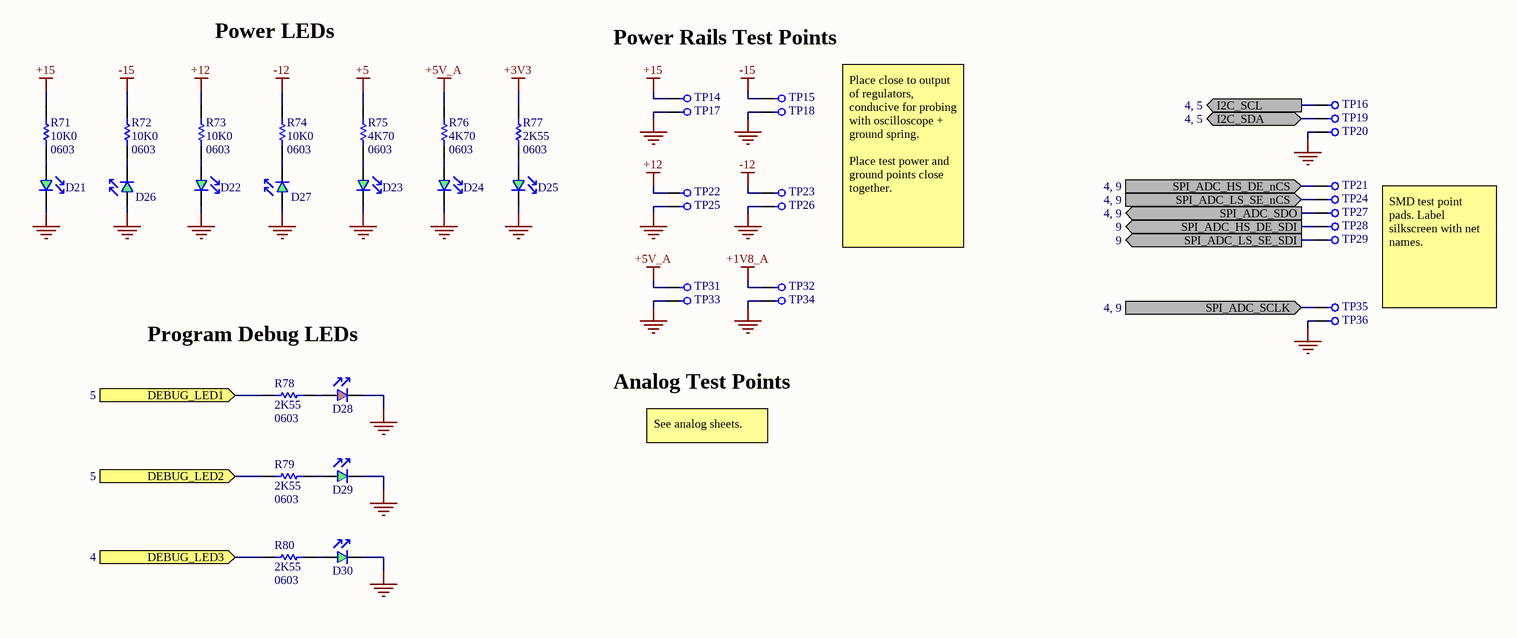
[diagram p10: Debug.SchDoc]

### Parts
D21  LED Green  [0603 LED]  (value not drawn)
D22  LED Green  [0603 LED]  (value not drawn)
D23  LED Green  [0603 LED]  (value not drawn)
D24  LED Green  [0603 LED]  (value not drawn)
D25  LED Green  [0603 LED]  (value not drawn)
D26  LED Green  [0603 LED]  (value not drawn)
D27  LED Green  [0603 LED]  (value not drawn)
D28  LED Red  [0603 LED]  (value not drawn)
D29  LED Green  [0603 LED]  (value not drawn)
D30  LED Green  [0603 LED]  (value not drawn)
R71  10K0  value 0603  [0603 RES]
R72  10K0  value 0603  [0603 RES]
R73  10K0  value 0603  [0603 RES]
R74  10K0  value 0603  [0603 RES]
R75  4K70  value 0603  [0603 RES]
R76  4K70  value 0603  [0603 RES]
R77  2K55  value 0603  [0603 RES]
R78  2K55  value 0603  [0603 RES]
R79  2K55  value 0603  [0603 RES]
R80  2K55  value 0603  [0603 RES]
TP14  Test Point  [Test Point Keystone 5015]  (value not drawn)
TP15  Test Point  [Test Point Keystone 5015]  (value not drawn)
TP16  Test Point  [TEST POINT SMD PAD]  (value not drawn)  (no BOM)
TP17  Test Point  [Test Point Keystone 5015]  (value not drawn)
TP18  Test Point  [Test Point Keystone 5015]  (value not drawn)
TP19  Test Point  [TEST POINT SMD PAD]  (value not drawn)  (no BOM)
TP20  Test Point  [TEST POINT SMD PAD]  (value not drawn)  (no BOM)
TP21  Test Point  [TEST POINT SMD PAD]  (value not drawn)  (no BOM)
TP22  Test Point  [Test Point Keystone 5015]  (value not drawn)
TP23  Test Point  [Test Point Keystone 5015]  (value not drawn)
TP24  Test Point  [TEST POINT SMD PAD]  (value not drawn)  (no BOM)
TP25  Test Point  [Test Point Keystone 5015]  (value not drawn)
TP26  Test Point  [Test Point Keystone 5015]  (value not drawn)
TP27  Test Point  [TEST POINT SMD PAD]  (value not drawn)  (no BOM)
TP28  Test Point  [TEST POINT SMD PAD]  (value not drawn)  (no BOM)
TP29  Test Point  [TEST POINT SMD PAD]  (value not drawn)  (no BOM)
TP31  Test Point  [Test Point Keystone 5015]  (value not drawn)
TP32  Test Point  [Test Point Keystone 5015]  (value not drawn)
TP33  Test Point  [Test Point Keystone 5015]  (value not drawn)
TP34  Test Point  [Test Point Keystone 5015]  (value not drawn)
TP35  Test Point  [TEST POINT SMD PAD]  (value not drawn)  (no BOM)
TP36  Test Point  [TEST POINT SMD PAD]  (value not drawn)  (no BOM)

### Ports
DEBUG_LED1 (in, see 5), DEBUG_LED2 (in, see 5), DEBUG_LED3 (in, see 4), I2C_SCL (out, see 4, 5), I2C_SDA (bidir, see 4, 5), SPI_ADC_HS_DE_nCS (in, see 4, 9), SPI_ADC_HS_DE_SDI (out, see 9), SPI_ADC_LS_SE_nCS (in, see 4, 9), SPI_ADC_LS_SE_SDI (out, see 9), SPI_ADC_SCLK (in, see 4, 9), SPI_ADC_SDO (out, see 4, 9)

### Nets
+1V8_A: TP32.1
+3V3: R77.2
+5: R75.2
+5V_A: R76.2 TP31.1
+12: R73.2 TP22.1
+15: R71.2 TP14.1
-12: R74.2 TP23.1
-15: R72.2 TP15.1
GND: D21.2(Cathode) D22.2(Cathode) D23.2(Cathode) D24.2(Cathode) D25.2(Cathode) D26.1(Anode) D27.1(Anode) D28.2(Cathode) D29.2(Cathode) D30.2(Cathode) TP17.1 TP18.1 TP20.1 TP25.1 TP26.1 TP33.1 TP34.1 TP36.1
DEBUG_LED1: R78.2 ; port DEBUG_LED1
DEBUG_LED2: R79.2 ; port DEBUG_LED2
DEBUG_LED3: R80.2 ; port DEBUG_LED3
I2C_SCL: TP16.1 ; port I2C_SCL
I2C_SDA: TP19.1 ; port I2C_SDA
SDI_HS_DE: TP28.1 ; port SPI_ADC_HS_DE_SDI
SDI_LS_SE: TP29.1 ; port SPI_ADC_LS_SE_SDI
SPI_ADC_HS_DE_nCS: TP21.1 ; port SPI_ADC_HS_DE_nCS
SPI_ADC_LS_SE_nCS: TP24.1 ; port SPI_ADC_LS_SE_nCS
SPI_ADC_SCLK: TP35.1 ; port SPI_ADC_SCLK
SPI_ADC_SDO: TP27.1 ; port SPI_ADC_SDO
NetD21_1: D21.1(Anode) R71.1
NetD22_1: D22.1(Anode) R73.1
NetD23_1: D23.1(Anode) R75.1
NetD24_1: D24.1(Anode) R76.1
NetD25_1: D25.1(Anode) R77.1
NetD26_2: D26.2(Cathode) R72.1
NetD27_2: D27.2(Cathode) R74.1
NetD28_1: D28.1(Anode) R78.1
NetD29_1: D29.1(Anode) R79.1
NetD30_1: D30.1(Anode) R80.1

### Notes on the sheet
- Power LEDs
- Power Rails Test Points
- Place close to output of regulators, conducive for probing with oscilloscope + ground spring.
  Place test power and ground points close together.
- SMD test point pads. Label silkscreen with net names.
- Program Debug LEDs
- Analog Test Points
- See analog sheets.
- Title
- Size:
- Date:
- B
- Revision:
- Time:
- Drawn By:
- Sheet
- of
- File:

### Library data of the parts
D21-D27 D29 D30 = LED Green: Generic Green LED
D28 = LED Red: Generic Red LED
R71-R80 = Res1: Resistor; Published: 8-Jun-2000; LatestRevisionDate: 17-Jul-2002; LatestRevisionNote: Re-released for DXP Platform.; PackageReference: AXIAL-0.3; Publisher: Altium Limited; PackageDescription: Axial Device, Thru-Hole; 2 Leads; 0.3 in Pin Spacing
TP14-TP29 TP31-TP36 = Test Point: Keystone 5015 Test point